# EAGLE schematic lp-servo12 (EAGLE 6.3)
DATABASE: /Users/joe/Documents/Projects/tronics/boards/lp-servo12/bom/bomex-partsdb.txt
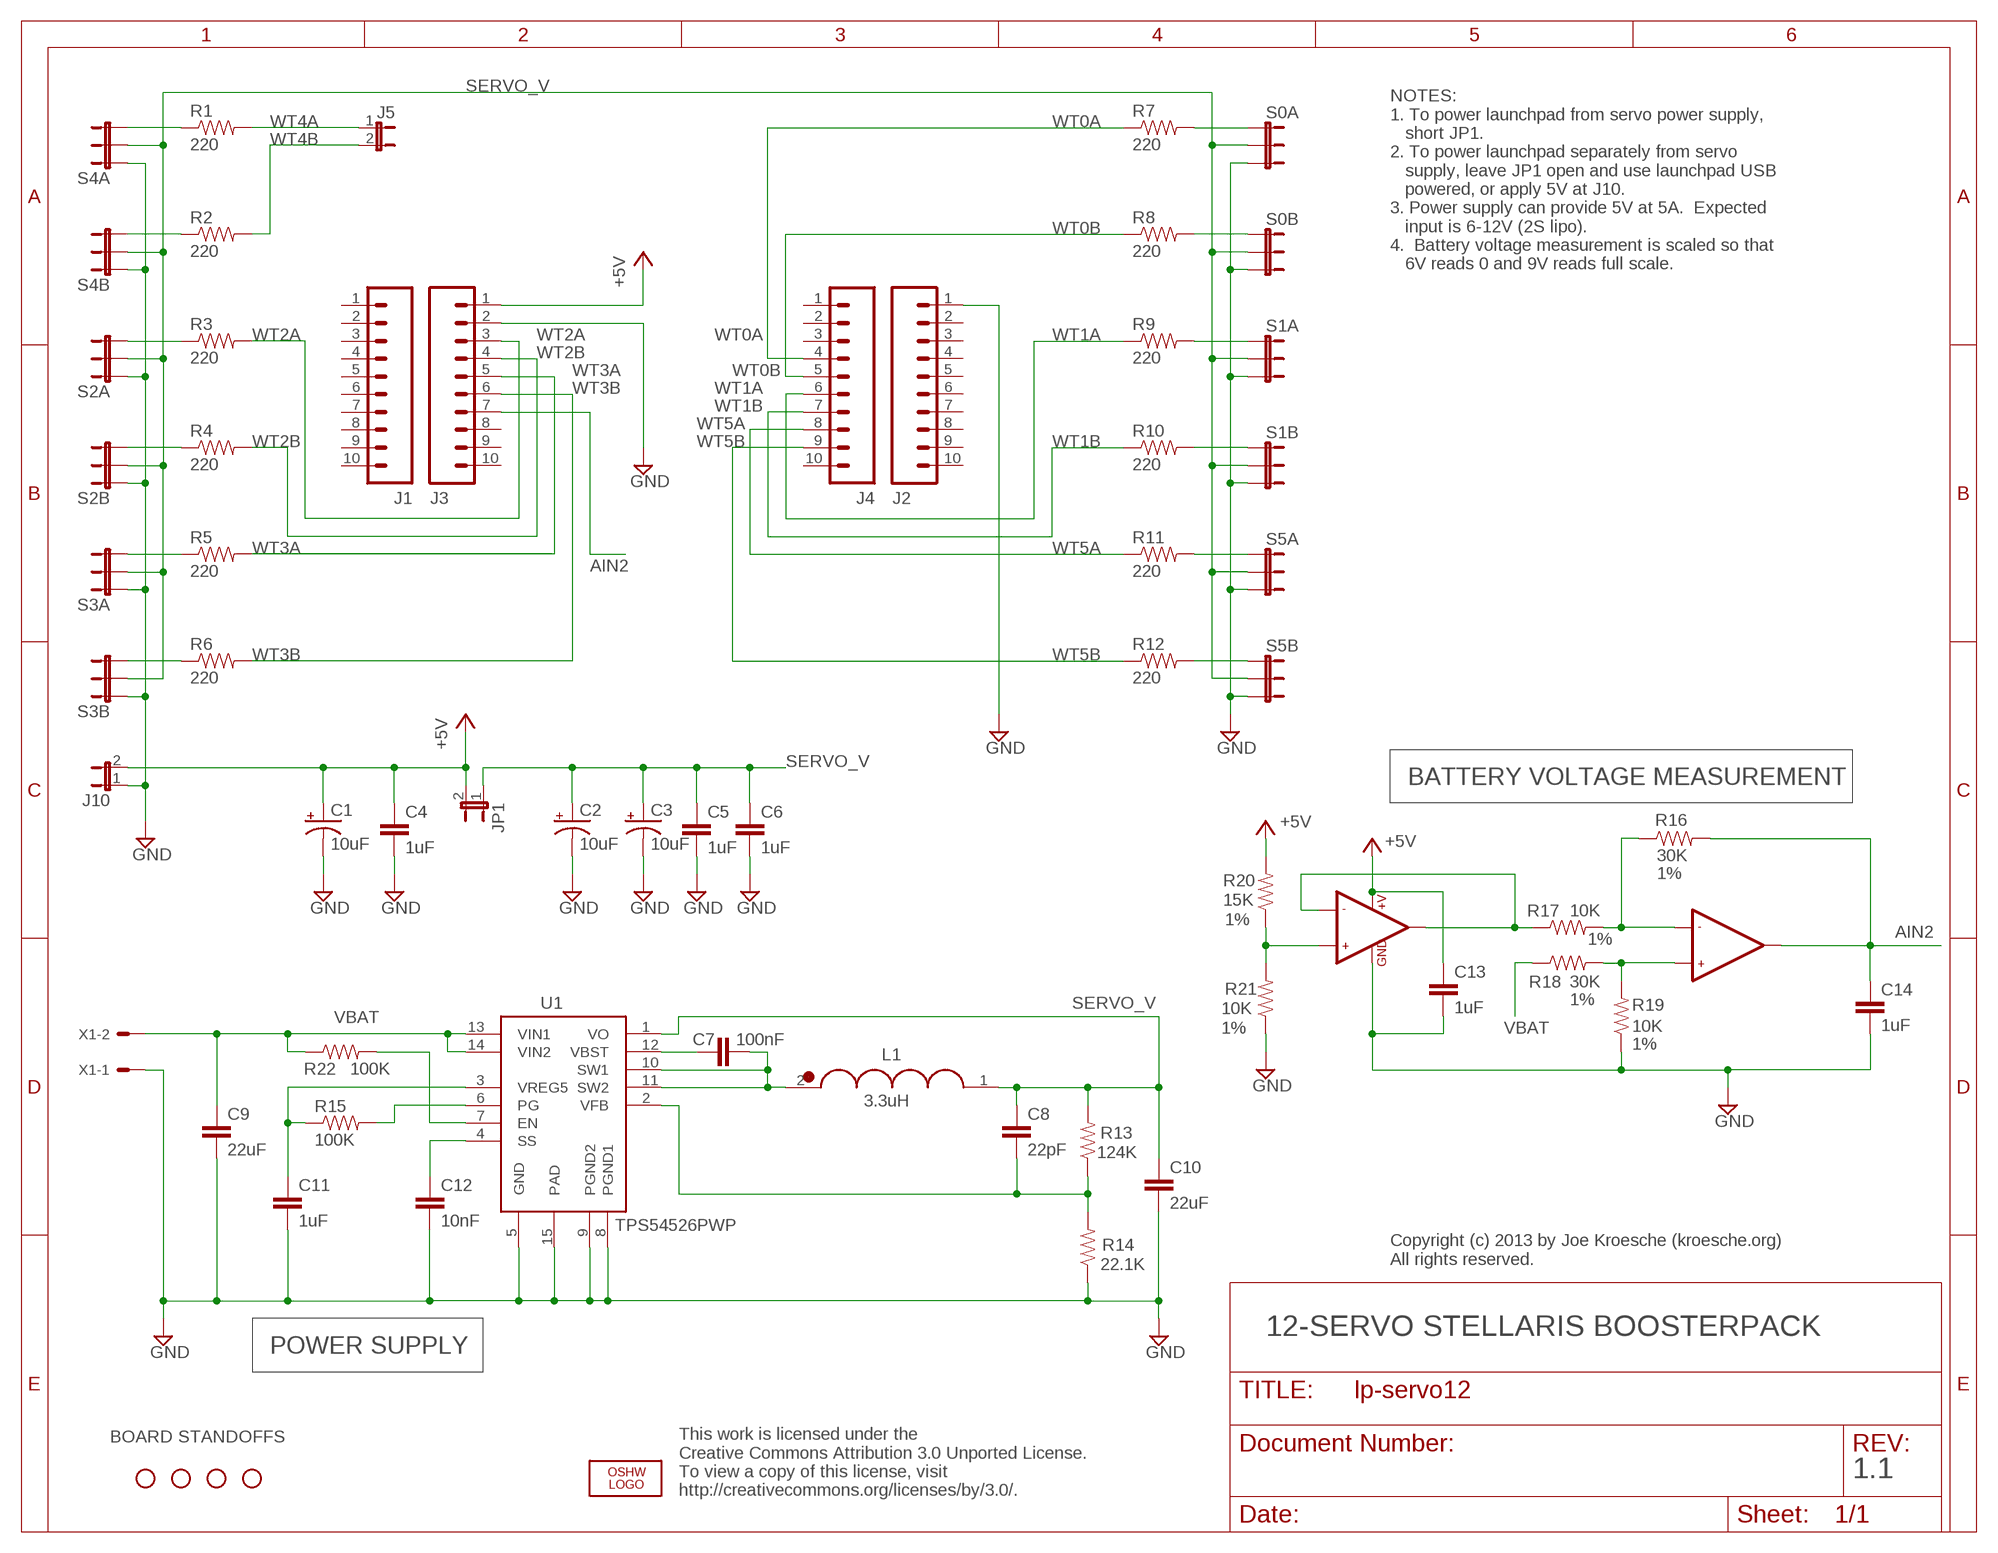
[diagram p0: schematic, sheet 1]

## Parts
C1  10uF  CAP_POL1206  [EIA3216]
C2  10uF  CAP_POL1206  [EIA3216]
C3  10uF  CAP_POL1206  [EIA3216]
C4  1uF  CAP0805  [0805]
C5  1uF  CAP0805  [0805]
C6  1uF  CAP0805  [0805]
C7  100nF  CAP0805  [0805]
C8  22pF  CAP0805  [0805]
C9  22uF  CAP1210  [1210]
C10  22uF  CAP1206  [1206]
C11  1uF  CAP0805  [0805]
C12  10nF  CAP0805  [0805]
C13  1uF  CAP0805  [0805]
C14  1uF  CAP0805  [0805]
J1  M10"  [1X10]
J2  M10"  [1X10]
J3  M10"  [1X10]
J4  M10"  [1X10]
J5  JUMPER-2PTH  [1X02]
J10  JUMPER-2PTH  [1X02]
JP1  JUMPER-2PTH  [1X02]
L1  3.3uH  VISHAY-IHLP-3232DZ-11  [VISHAY-IHLP3232DZER]
LOGO2  OSHW_LOGO_6MILX0200-NT  [OSHW_6X200_NOTEXT]
R1  220  RESISTOR0805-RES  [0805]
R2  220  RESISTOR0805-RES  [0805]
R3  220  RESISTOR0805-RES  [0805]
R4  220  RESISTOR0805-RES  [0805]
R5  220  RESISTOR0805-RES  [0805]
R6  220  RESISTOR0805-RES  [0805]
R7  220  RESISTOR0805-RES  [0805]
R8  220  RESISTOR0805-RES  [0805]
R9  220  RESISTOR0805-RES  [0805]
R10  220  RESISTOR0805-RES  [0805]
R11  220  RESISTOR0805-RES  [0805]
R12  220  RESISTOR0805-RES  [0805]
R13  124K  RESISTOR0805-RES  [0805]
R14  22.1K  RESISTOR0805-RES  [0805]
R15  100K  RESISTOR0805-RES  [0805]
R16  30K  RESISTOR0805-RES  [0805]
R17  10K  RESISTOR0805-RES  [0805]
R18  30K  RESISTOR0805-RES  [0805]
R19  10K  RESISTOR0805-RES  [0805]
R20  15K  RESISTOR0805-RES  [0805]
R21  10K  RESISTOR0805-RES  [0805]
R22  100K  RESISTOR0805-RES  [0805]
S0A  JUMPER-3PTH  [1X03]
S0B  JUMPER-3PTH  [1X03]
S1A  JUMPER-3PTH  [1X03]
S1B  JUMPER-3PTH  [1X03]
S2A  JUMPER-3PTH  [1X03]
S2B  JUMPER-3PTH  [1X03]
S3A  JUMPER-3PTH  [1X03]
S3B  JUMPER-3PTH  [1X03]
S4A  JUMPER-3PTH  [1X03]
S4B  JUMPER-3PTH  [1X03]
S5A  JUMPER-3PTH  [1X03]
S5B  JUMPER-3PTH  [1X03]
STANDOFF1  STAND-OFF  [STAND-OFF]
STANDOFF2  STAND-OFF  [STAND-OFF]
STANDOFF3  STAND-OFF  [STAND-OFF]
STANDOFF4  STAND-OFF  [STAND-OFF]
U1  TPS54526PWP  [PWP-R-PDSO-G14]
U2  LMV358  [SO08]
X1  KK-156-2  [KK-156-2]

## Nets
+5V: C1.A(+) C4.1 C13.1 J3.1 J10.2 JP1.2 R20.2 U2.8(+V)
AIN2: C14.1 J3.7 R16.2 U2.7(OUT2)
GND: C1.C(-) C2.C(-) C3.C(-) C4.2 C5.2 C6.2 C9.2 C10.2 C11.2 C12.2 C13.2 C14.2 J2.1 J3.2 J10.1 R14.1 R19.1 R21.1 S0A.3 S0B.3 S1A.3 S1B.3 S2A.1 S2B.1 S3A.1 S3B.1 S4A.1 S4B.1 S5A.3 S5B.3 U1.5(GND) U1.8(PGND1) U1.9(PGND2) U1.15(PAD) U2.4(GND) X1.1
N$1: R1.1 S4A.3
N$2: C7.1 U1.12(VBST)
N$3: R2.1 S4B.3
N$4: R3.1 S2A.3
N$5: R4.1 S2B.3
N$6: R5.1 S3A.3
N$7: C7.2 L1.2(POS) U1.10(SW1) U1.11(SW2)
N$8: R16.1 R17.2 U2.6(-IN2)
N$9: R7.2 S0A.1
N$10: R6.1 S3B.3
N$11: R8.2 S0B.1
N$12: R9.2 S1A.1
N$13: R10.2 S1B.1
N$14: R11.2 S5A.1
N$15: R12.2 S5B.1
N$16: C8.2 R13.1 R14.2 U1.2(VFB)
N$17: R18.2 R19.2 U2.5(+IN2)
N$18: R15.2 U1.6(PG)
N$19: R22.2 U1.7(EN)
N$20: C12.1 U1.4(SS)
N$21: R17.1 U2.1(OUT1) U2.2(-IN1)
N$22: C11.1 R15.1 U1.3(VREG5)
N$23: R20.1 R21.2 U2.3(+IN1)
SERVO_V: C2.A(+) C3.A(+) C5.1 C6.1 C8.1 C10.1 JP1.1 L1.1(NEG) R13.2 S0A.2 S0B.2 S1A.2 S1B.2 S2A.2 S2B.2 S3A.2 S3B.2 S4A.2 S4B.2 S5A.2 S5B.2 U1.1(VO)
VBAT: C9.1 R18.1 R22.1 U1.13(VIN1) U1.14(VIN2) X1.2
WT0A: J4.4 R7.1
WT0B: J4.5 R8.1
WT1A: J4.6 R9.1
WT1B: J4.7 R10.1
WT2A: J3.3 R3.2
WT2B: J3.4 R4.2
WT3A: J3.5 R5.2
WT3B: J3.6 R6.2
WT4A: J5.1 R1.2
WT4B: J5.2 R2.2
WT5A: J4.8 R11.1
WT5B: J4.9 R12.1
Unconnected: J1.1 J1.2 J1.3 J1.4 J1.5 J1.6 J1.7 J1.8 J1.9 J1.10 J2.2 J2.3 J2.4 J2.5 J2.6 J2.7 J2.8 J2.9 J2.10 J3.8 J3.9 J3.10 J4.1 J4.2 J4.3 J4.10

## Notes on the sheet
- NOTES:
  1. To power launchpad from servo power supply,
     short JP1.
  2. To power launchpad separately from servo
     supply, leave JP1 open and use launchpad USB
     powered, or apply 5V at J10.
  3. Power supply can provide 5V at 5A.  Expected
     input is 6-12V (2S lipo).
  4.  Battery voltage measurement is scaled so that
     6V reads 0 and 9V reads full scale.
- BATTERY VOLTAGE MEASUREMENT
- Copyright (c) 2013 by Joe Kroesche (kroesche.org)
  All rights reserved.
- 12-SERVO STELLARIS BOOSTERPACK
- POWER SUPPLY
- BOARD STANDOFFS
- 1.1
- This work is licensed under the
  Creative Commons Attribution 3.0 Unported License.
  To view a copy of this license, visit
  http://creativecommons.org/licenses/by/3.0/.

## Library data of the parts
C1-C3 = SparkFun-Passives:CAP_POL: Capacitor Polarized These are standard SMD and PTH capacitors. Normally 10uF, 47uF, and 100uF in electrolytic and tantalum varieties. Always verify the external diameter of the through hole cap, it varies with capacity, voltage, and manufacturer. The EIA devices should be standard.; PARTNO: CAP_10u_20V_20PCT_1206; SIZE: (1206); TOL: 20%; TYPE: TANT; VOLT: 20V
C4-C6 C11 C13 C14 = SparkFun-Passives:CAP: Capacitor Standard 0603 ceramic capacitor, and 0.1" leaded capacitor.; PARTNO: CAP_1u_20V_20PCT_0805; SIZE: (0805); TOL: 20%; VOLT: 20V
C7 = SparkFun-Passives:CAP: Capacitor Standard 0603 ceramic capacitor, and 0.1" leaded capacitor.; PARTNO: CAP_100n_25V_10PCT_0805; SIZE: (0805); TC: X7R; TOL: 10%; VOLT: 25V
C8 = SparkFun-Passives:CAP: Capacitor Standard 0603 ceramic capacitor, and 0.1" leaded capacitor.; PARTNO: CAP_22p_50V_10PCT_0805; SIZE: (0805); TC: C0G; TOL: 10%; VOLT: 50V
C9 = SparkFun-Passives:CAP: Capacitor Standard 0603 ceramic capacitor, and 0.1" leaded capacitor.; PARTNO: CAP_22u_16V_10PCT_1210; SIZE: (1210); TC: X5R; TOL: 10%; VOLT: 16V
C10 = SparkFun-Passives:CAP: Capacitor Standard 0603 ceramic capacitor, and 0.1" leaded capacitor.; PARTNO: CAP_22u_16V_20PCT_1206; SIZE: (1206); TC: X5R; TOL: 20%; VOLT: 16V
C12 = SparkFun-Passives:CAP: Capacitor Standard 0603 ceramic capacitor, and 0.1" leaded capacitor.; PARTNO: CAP_10n_50V_10PCT_0805; SIZE: (0805); TC: X7R; TOL: 10%; VOLT: 50V
J1-J4 = SparkFun-Connectors:M10: Header 10 Standard 10-pin 0.1" header. Use with straight break away headers (SKU : PRT-00116), right angle break away headers (PRT-00553), swiss pins (PRT-00743), machine pins (PRT-00117), and female headers (PRT-00115).; PARTNO: 68002-110HLF
J5 JP1 = SparkFun-Passives:JUMPER-2: Jumper Basic 0.1" spaced jumper. Use with breakaway headers.; PARTNO: 68002-202HLF
J10 = SparkFun-Passives:JUMPER-2: Jumper Basic 0.1" spaced jumper. Use with breakaway headers.; PARTNO: 68016-402
L1 = kroesche:VISHAY-IHLP-3232DZ-11: Low Profile High Current IHLP Inductor from Vishay-Dale; LOAD: 10A; MANF: Vishay/Dale; MANF#: IHLP3232DZER3R3M11; MOUSER#: 70-IHLP3232DZER3R3M11; PARTNO: IHLP3232DZER3R3M11; TOL: 20%
LOGO2 = ohw-logo:OSHW_LOGO_6MIL; BOM: EXCLUDE
R1 = SparkFun-Resistors:RESISTOR: Resistor Basic schematic elements and footprints for 0603, 1206, and PTH resistors.; MANF: Panasonic; MANF#: ERJ-6GEYJ221V; MOUSER#: 667-ERJ-6GEYJ221V; PARTNO: RES_220_20V_10PCT_0805; SIZE: (0805); TOL: 10%; VOLT: 50V
R2-R12 = SparkFun-Resistors:RESISTOR: Resistor Basic schematic elements and footprints for 0603, 1206, and PTH resistors.; PARTNO: RES_220_20V_10PCT_0805; SIZE: (0805); TOL: 10%; VOLT: 50V
R13 = SparkFun-Resistors:RESISTOR: Resistor Basic schematic elements and footprints for 0603, 1206, and PTH resistors.; PARTNO: RES_124K_20V_1PCT_0805; RATE: 1/8W; SIZE: (0805); TOL: 1%; VOLT: 20V
R14 = SparkFun-Resistors:RESISTOR: Resistor Basic schematic elements and footprints for 0603, 1206, and PTH resistors.; PARTNO: RES_22.1K_20V_1PCT_0805; RATE: 1/8W; SIZE: (0805); TOL: 1%; VOLT: 20V
R15 R22 = SparkFun-Resistors:RESISTOR: Resistor Basic schematic elements and footprints for 0603, 1206, and PTH resistors.; PARTNO: RES_100K_20V_1PCT_0805; RATE: 1/8W; SIZE: (0805); TOL: 1%; VOLT: 20V
R16 R18 = SparkFun-Resistors:RESISTOR: Resistor Basic schematic elements and footprints for 0603, 1206, and PTH resistors.; PARTNO: RES_30K_20V_1PCT_0805; SIZE: (0805); TOL: 1%; VOLT: 20V
R17 R19 R21 = SparkFun-Resistors:RESISTOR: Resistor Basic schematic elements and footprints for 0603, 1206, and PTH resistors.; PARTNO: RES_10K_20V_1PCT_0805; SIZE: (0805); TOL: 1%; VOLT: 20V
R20 = SparkFun-Resistors:RESISTOR: Resistor Basic schematic elements and footprints for 0603, 1206, and PTH resistors.; PARTNO: RES_15K_20V_1PCT_0805; SIZE: (0805); TOL: 1%; VOLT: 20V
S0A S0B S1A S1B S2A S2B S3A S3B S4A S4B S5A S5B = SparkFun-Passives:JUMPER-3; PARTNO: 68002-403HLF
STANDOFF1-STANDOFF4 = SparkFun-Electromechanical:STAND-OFF: #4 Stand Off This is the mechanical footprint for a #4 phillips button head screw. Use the keepout ring to avoid running the screw head into surrounding components. SKU : PRT-00447; BOM: EXCLUDE
U1 = kroesche:TPS54526; MANF: Texas Instruments; MANF#: TPS54526PWP; MOUSER#: 595-TPS54526PWP; PARTNO: TPS54526PWP
U2 = SparkFun-AnalogIC:LMV358: Jellybean rail-to-rail output op-amp; MANF: Texas Instruments; MANF#: LMV358QDR; MOUSER#: 595-LMV358QDR; PARTNO: LMV358QDR
X1 = con-molex:KK-156-2: KK 156 HEADER Source: http://www.molex.com/pdm_docs/sd/026604100_sd.pdf; MANF: Molex; MANF#: 76650-0208; MOUSER#: 538-76650-0208; OC_FARNELL: unknown; OC_NEWARK: unknown; PARTNO: KK-156-2-LOCK-RTANGLE